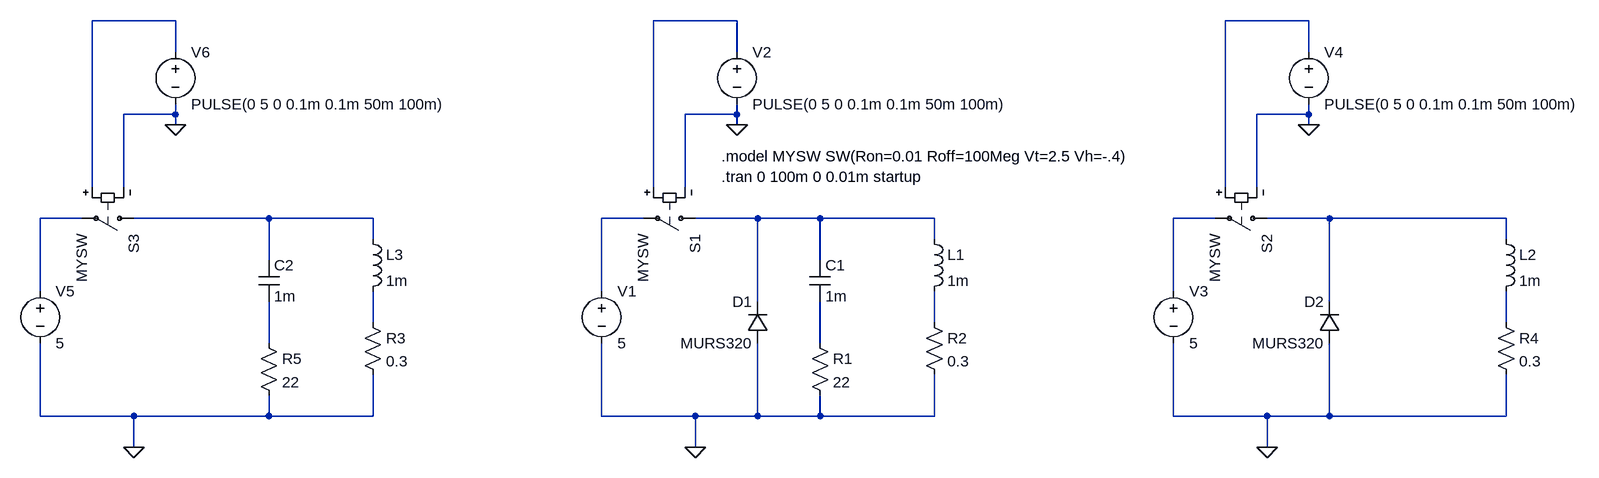
[diagram p0: schematic sim.asc]
sim.asc, the LTspice schematic file:
Version 4
SHEET 1 1304 680
WIRE -880 -256 -1008 -256
WIRE -16 -256 -144 -256
WIRE 864 -256 736 -256
WIRE -880 -208 -880 -256
WIRE -16 -208 -16 -256
WIRE 864 -208 864 -256
WIRE -880 -112 -880 -128
WIRE -880 -112 -960 -112
WIRE -16 -112 -16 -128
WIRE -16 -112 -96 -112
WIRE 864 -112 864 -128
WIRE 864 -112 784 -112
WIRE -880 -96 -880 -112
WIRE -16 -96 -16 -112
WIRE 864 -96 864 -112
WIRE -1008 0 -1008 -256
WIRE -960 0 -960 -112
WIRE -144 0 -144 -256
WIRE -96 0 -96 -112
WIRE 736 0 736 -256
WIRE 784 0 784 -112
WIRE -1024 48 -1088 48
WIRE -736 48 -944 48
WIRE -576 48 -736 48
WIRE -160 48 -224 48
WIRE 16 48 -80 48
WIRE 112 48 16 48
WIRE 288 48 112 48
WIRE 720 48 656 48
WIRE 896 48 800 48
WIRE 1168 48 896 48
WIRE -576 80 -576 48
WIRE 288 80 288 48
WIRE 1168 80 1168 48
WIRE -736 112 -736 48
WIRE 112 112 112 48
WIRE -1088 160 -1088 48
WIRE -224 160 -224 48
WIRE 656 160 656 48
WIRE 16 176 16 48
WIRE 896 176 896 48
WIRE -576 208 -576 160
WIRE 288 208 288 160
WIRE 1168 208 1168 160
WIRE -736 240 -736 176
WIRE 112 240 112 176
WIRE -1088 352 -1088 240
WIRE -944 352 -1088 352
WIRE -736 352 -736 320
WIRE -736 352 -944 352
WIRE -576 352 -576 288
WIRE -576 352 -736 352
WIRE -224 352 -224 240
WIRE -80 352 -224 352
WIRE 16 352 16 240
WIRE 16 352 -80 352
WIRE 112 352 112 320
WIRE 112 352 16 352
WIRE 288 352 288 288
WIRE 288 352 112 352
WIRE 656 352 656 240
WIRE 800 352 656 352
WIRE 896 352 896 240
WIRE 896 352 800 352
WIRE 1168 352 1168 288
WIRE 1168 352 896 352
WIRE -944 400 -944 352
WIRE -80 400 -80 352
WIRE 800 400 800 352
FLAG -80 400 0
FLAG -16 -96 0
FLAG 800 400 0
FLAG 864 -96 0
FLAG -944 400 0
FLAG -880 -96 0
SYMBOL ind 272 64 R0
SYMATTR InstName L1
SYMATTR Value 1m
SYMBOL res 96 224 R0
SYMATTR InstName R1
SYMATTR Value 22
SYMBOL cap 96 112 R0
SYMATTR InstName C1
SYMATTR Value 1m
SYMBOL diode 32 240 R180
WINDOW 0 24 64 Left 2
WINDOW 3 24 0 Left 2
SYMATTR InstName D1
SYMATTR Value MURS320
SYMBOL res 272 192 R0
SYMATTR InstName R2
SYMATTR Value 0.3
SYMBOL voltage -224 144 R0
WINDOW 123 0 0 Left 0
WINDOW 39 0 0 Left 0
SYMATTR InstName V1
SYMATTR Value 5
SYMBOL sw -64 48 R90
SYMATTR InstName S1
SYMATTR Value MYSW
SYMBOL voltage -16 -224 R0
WINDOW 123 0 0 Left 0
WINDOW 39 0 0 Left 0
SYMATTR InstName V2
SYMATTR Value PULSE(0 5 0 0.1m 0.1m 50m 100m)
SYMBOL ind 1152 64 R0
SYMATTR InstName L2
SYMATTR Value 1m
SYMBOL diode 912 240 R180
WINDOW 0 24 64 Left 2
WINDOW 3 24 0 Left 2
SYMATTR InstName D2
SYMATTR Value MURS320
SYMBOL res 1152 192 R0
SYMATTR InstName R4
SYMATTR Value 0.3
SYMBOL voltage 656 144 R0
WINDOW 123 0 0 Left 0
WINDOW 39 0 0 Left 0
SYMATTR InstName V3
SYMATTR Value 5
SYMBOL sw 816 48 R90
SYMATTR InstName S2
SYMATTR Value MYSW
SYMBOL voltage 864 -224 R0
WINDOW 123 0 0 Left 0
WINDOW 39 0 0 Left 0
SYMATTR InstName V4
SYMATTR Value PULSE(0 5 0 0.1m 0.1m 50m 100m)
SYMBOL ind -592 64 R0
SYMATTR InstName L3
SYMATTR Value 1m
SYMBOL res -592 192 R0
SYMATTR InstName R3
SYMATTR Value 0.3
SYMBOL voltage -1088 144 R0
WINDOW 123 0 0 Left 0
WINDOW 39 0 0 Left 0
SYMATTR InstName V5
SYMATTR Value 5
SYMBOL sw -928 48 R90
SYMATTR InstName S3
SYMATTR Value MYSW
SYMBOL voltage -880 -224 R0
WINDOW 123 0 0 Left 0
WINDOW 39 0 0 Left 0
SYMATTR InstName V6
SYMATTR Value PULSE(0 5 0 0.1m 0.1m 50m 100m)
SYMBOL res -752 224 R0
SYMATTR InstName R5
SYMATTR Value 22
SYMBOL cap -752 112 R0
SYMATTR InstName C2
SYMATTR Value 1m
TEXT -40 -16 Left 2 !.tran 0 100m 0 0.01m startup
TEXT -40 -48 Left 2 !.model MYSW SW(Ron=0.01 Roff=100Meg Vt=2.5 Vh=-.4)

The netlist it stands for:
* sim.asc
L1 N007 N011 1m
R1 N014 0 22
C1 N007 N014 1m
D1 0 N007 MURS320
R2 N011 0 0.3
V1 N006 0 5
S1 N007 N006 N002 0 MYSW
V2 N002 0 PULSE(0 5 0 0.1m 0.1m 50m 100m)
L2 N009 N012 1m
D2 0 N009 MURS320
R4 N012 0 0.3
V3 N008 0 5
S2 N009 N008 N003 0 MYSW
V4 N003 0 PULSE(0 5 0 0.1m 0.1m 50m 100m)
L3 N005 N010 1m
R3 N010 0 0.3
V5 N004 0 5
S3 N005 N004 N001 0 MYSW
V6 N001 0 PULSE(0 5 0 0.1m 0.1m 50m 100m)
R5 N013 0 22
C2 N005 N013 1m
.model D D
.lib standard.dio
.tran 0 100m 0 0.01m startup
.model MYSW SW(Ron=0.01 Roff=100Meg Vt=2.5 Vh=-.4)
.backanno
.end